# Altium schematic sheet Duty_cycle_BDD_1.SchDoc
size A4
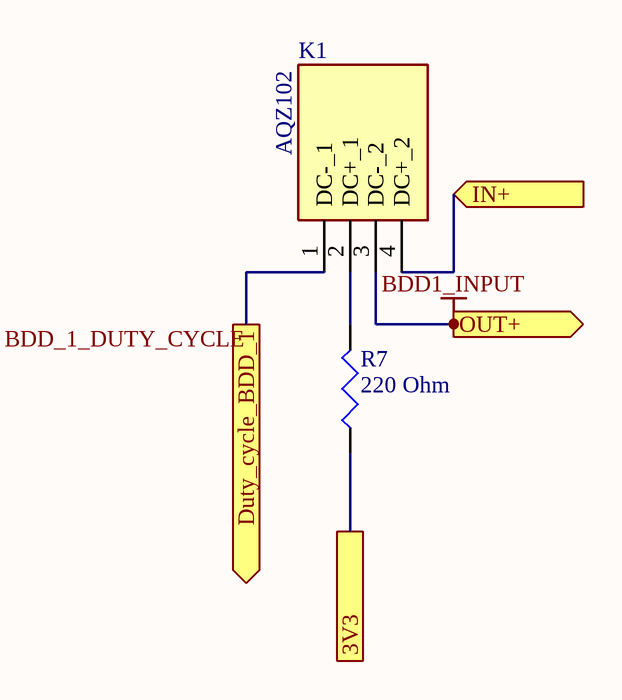
[diagram p0: Duty_cycle_BDD_1.SchDoc]

## Parts
K1  AQZ102  [AQZ102]
R7  220 Ohm  [J1-0603]

## Ports
3V3, Duty_cycle_BDD_1 (out), IN+ (in), OUT+ (out)

## Nets
BDD1_INPUT: K1.3(DC-_2) ; port OUT+
3V3: R7.1 ; port 3V3
BDD_1_DUTY_CYCLE: K1.1(DC-_1) ; port Duty_cycle_BDD_1
IN+: K1.4(DC+_2) ; port IN+
NetK1_2: K1.2(DC+_1) R7.2

## Library data of the parts
K1 = AQZ102: Relay or Contactor; Manufacturer_Name: Panasonic; Datasheet Link: https://industrial.panasonic.com/ac/cdn/e/control/relay/photomos/catalog/semi_eng_pwr1a_aqz10_20.pdf; Height: 11mm; Manufacturer_Part_Number: AQZ102; Arrow Part Number: AQZ102; Arrow Price/Stock: https://www.arrow.com/en/products/aqz102/panasonic; Mouser Part Number: 769-AQZ102; Mouser Price/Stock: https://www.mouser.co.uk/ProductDetail/Panasonic-Industrial-Devices/AQZ102?qs=tR16lFwwUU%2FVYpsj8M3w%252BA%3D%3D
R7 = Res3: Resistor; Value: 10K; Published: 8-Jun-2000; LatestRevisionDate: 29-May-2009; LatestRevisionNote: IPC-7351 Footprint Added.; PackageReference: J1-0603; Publisher: Altium Limited; PackageDescription: Chip Resistor